# Altium schematic sheet vizics.SchDoc: Scalony Skaner Bioimpedancji
size A4; DrawnBy: Łukasz Przeniosło; Organization: Zachodniopomorski; Address1: Uniwersytet Technologiczny; Address2: w Szczecinie; Address3: Wydział Elektryczny; Address4: Katedra KISSE; Revision: 1.0; SheetNumber: 5; SheetTotal: 7
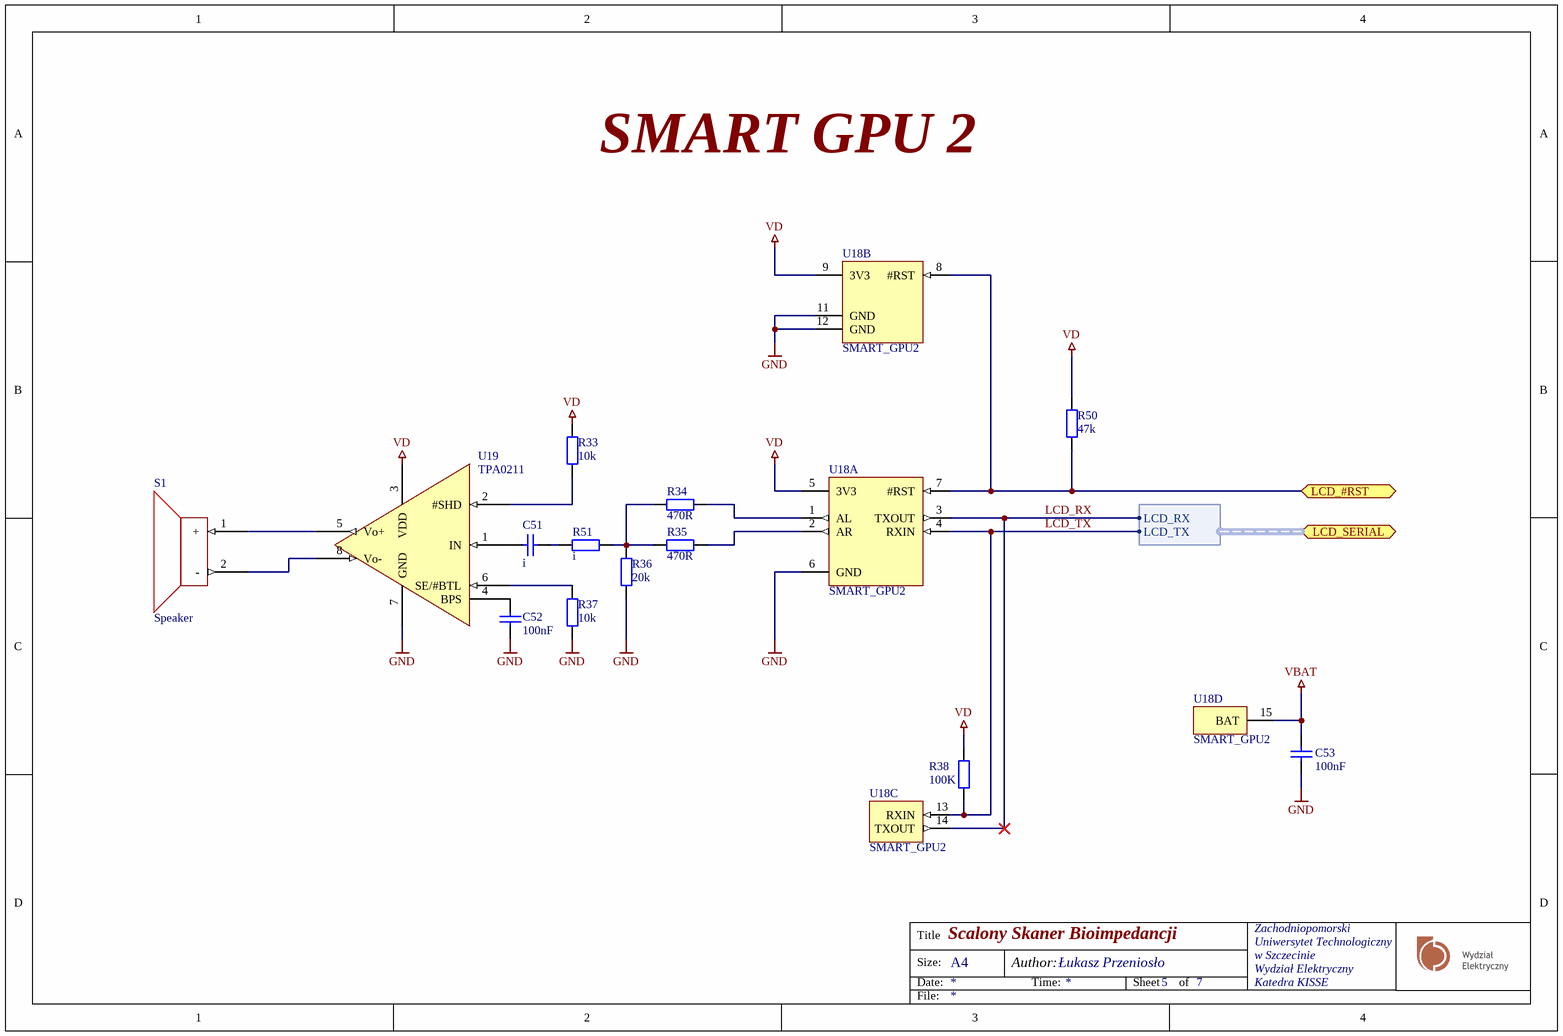
[diagram p0: vizics.SchDoc]

## Parts
C51  i  [CAPC1608N]
C52  100nF  [CAPC1608N]
C53  100nF  [CAPC1608N]
R33  10k  [RESC1608N]
R34  470R  [RESC1608N]
R35  470R  [RESC1608N]
R36  20k  [RESC1608N]
R37  10k  [RESC1608N]
R38  100K  [RESC1608N]
R50  47k  [RESC1608N]
R51  i  [RESC1608N]
S1  Speaker  [MX-02227-2021]
U18  SMART_GPU2  [LCD_HEADERS]  (parts A,B,C,D of 4)
U19  TPA0211  [SOIC127P600-8AL]

## Ports
LCD_#RST, LCD_SERIAL (harness LCD_SERIAL)

## Harnesses
LCD_SERIAL: LCD_TX, LCD_RX

## Nets
GND: C52.2 C53.1 R36.2 R37.1 U18.6(GND) U18.11(GND) U18.12(GND) U19.7(GND)
VBAT: C53.2 U18.15(BAT)
VD: R33.1 R38.2 R50.1 U18.5(3V3) U18.9(3V3) U19.3(VDD)
LCD_#RST: R50.2 U18.7(#RST) U18.8(#RST) ; port LCD_#RST
LCD_RX: U18.3(TXOUT) U18.14(TXOUT) ; port LCD_SERIAL.LCD_RX
LCD_TX: R38.1 U18.4(RXIN) U18.13(RXIN) ; port LCD_SERIAL.LCD_TX
NetC51_1: C51.1 R51.2
NetC51_2: C51.2 U19.1(IN)
NetC52_1: C52.1 U19.4(BPS)
NetR33_2: R33.2 U19.2(#SHD)
NetR34_1: R34.1 U18.1(AL)
NetR34_2: R34.2 R35.2 R36.1 R51.1
NetR35_1: R35.1 U18.2(AR)
NetR37_2: R37.2 U19.6(SE/#BTL)
NetS1_1: S1.1(+) U19.5(Vo+)
NetS1_2: S1.2(-) U19.8(Vo-)

Not connected (* = marked no-connect by the designer): U18 10(NC)

## Notes on the sheet
- SMART GPU 2
- Title
- Size:
- Date:
- A4
- Author:
- Time:
- Sheet
- of
- File:

## Library data of the parts
C51-C53 = Capacitor
  C51: Value: i
  C52 C53: Value: 100nF
R33-R37 R50 R51 = Resistor: Tolerance: 5%; Power: 0W
  R33 R37: Value: 10k
  R34 R35: Value: 470R
  R36: Value: 20k
  R50: Value: 47k
  R51: Value: i
R38 = Resistor: Power: 0W; Tolerance: 5%; Value: 100K